# EAGLE design simple-loop-active1 (EAGLE 6.6.0)

## Sheet 1 of 2
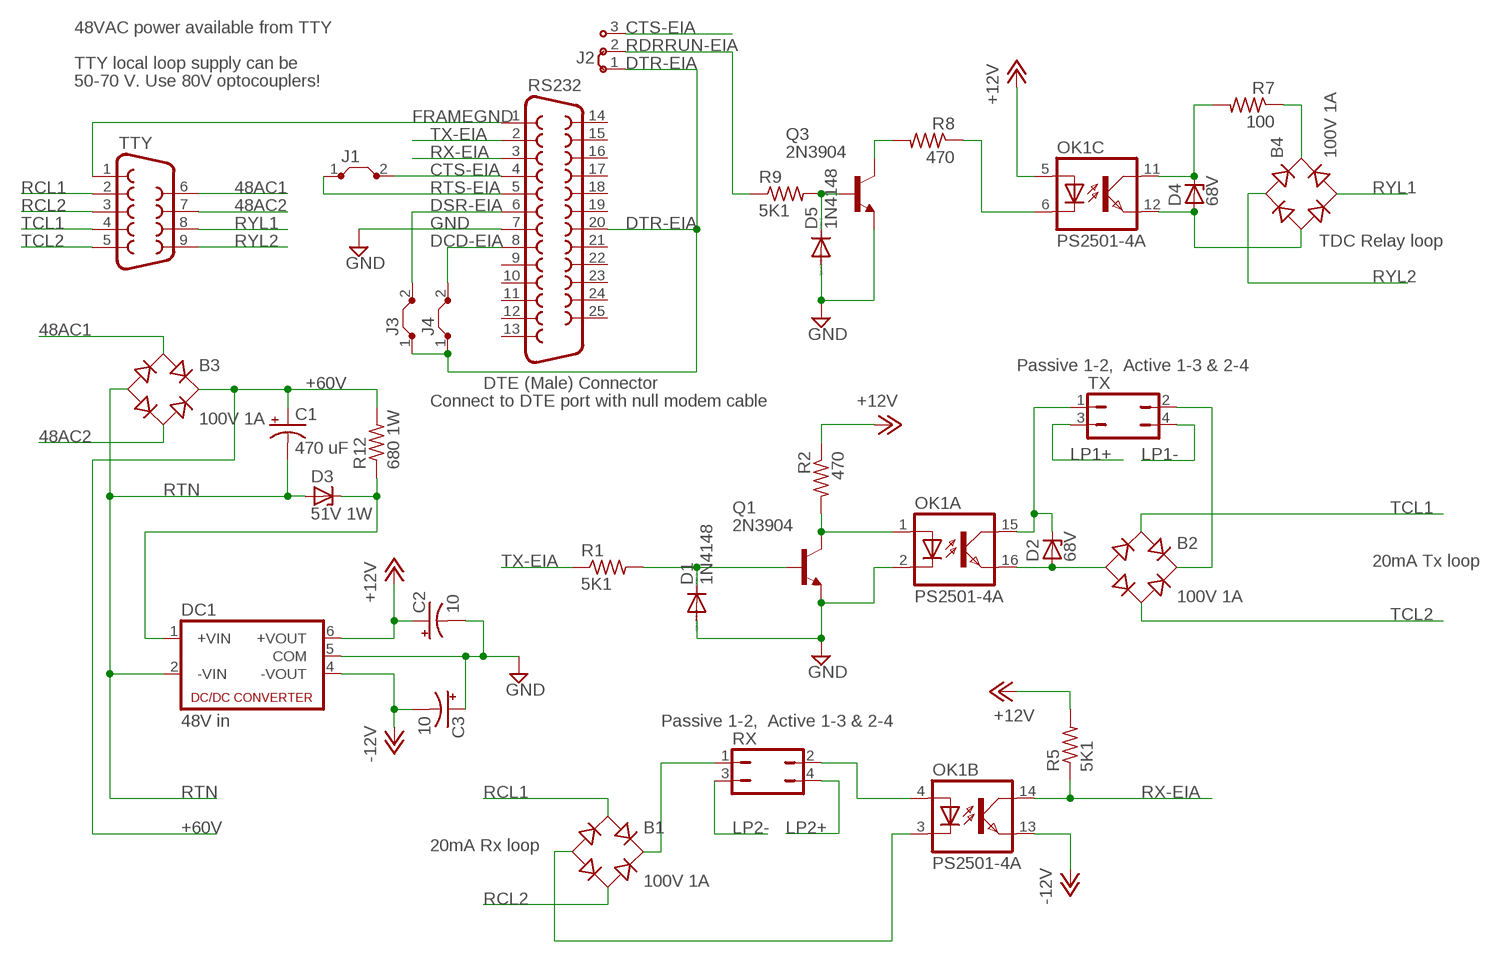
[diagram p0: schematic, sheet 1]

### Parts
B1  100V 1A  RB1A  [RB1A]
B2  100V 1A  RB1A  [RB1A]
B3  100V 1A  RB1A  [RB1A]
B4  100V 1A  RB1A  [RB1A]
C1  470 uF  CPOL-USE7.5-18  [E7,5-18]
C2  10  CPOL-USB45181A  [B45181A]
C3  10  CPOL-USB45181A  [B45181A]
D1  1N4148  1N4148DO35-10  [DO35-10]
D2  68V  ZENER-DIODEDO41Z10  [DO41Z10]
D3  51V 1W  ZENER-DIODEDO41Z10  [DO41Z10]
D4  68V  ZENER-DIODEDO41Z10  [DO41Z10]
D5  1N4148  1N4148DO35-10  [DO35-10]
DC1  48V in  NMA  [NMA]
J1  J5MM  [05]
J2  J2X5MM  [05C]
J3  J5MM  [05]
J4  J5MM  [05]
OK1  PS2501-4A  ILQ1  [DIL16]
Q1  2N3904  [TO92]
Q3  2N3904  [TO92]
R1  5K1  R-US_0207/10  [0207/10]
R2  470  R-US_0207/10  [0207/10]
R5  5K1  R-US_0207/10  [0207/10]
R7  100  R-US_0207/10  [0207/10]
R8  470  R-US_0207/10  [0207/10]
R9  5K1  R-US_0207/10  [0207/10]
R12  680 1W  R-US_0817/7V  [P0817V]
RS232  F25H  [F25H]
RX  JP2Q  [JP2Q]
TTY  F09H  [F09H]
TX  JP2Q  [JP2Q]

### Nets
48AC1: B3.AC1 TTY.6
48AC2: B3.AC2 TTY.7
+12V: C2.+ DC1.6(+VOUT) OK1.5(C:A) R2.1 R5.2
+48VDC: D3.C DC1.1(+VIN) R12.1
+60V: B3.+ C1.+ R12.2 ; also sheet 2
-12V: C3.- DC1.4(-VOUT) OK1.13(B:EMIT)
CTS-EIA: J1.2 J2.3 RS232.4
DCD-EIA: J4.2 RS232.8
DSR-EIA: J3.2 RS232.6
DTR-EIA: J2.1 J3.1 J4.1 RS232.20
FRAMEGND: RS232.1 TTY.1
GND [GND]: C2.- C3.+ D1.A D5.A DC1.5(COM) OK1.2(A:C) Q1.3(E) Q3.3(E) RS232.7
LP1+: TX.3 ; also sheet 2
LP1-: TX.4 ; also sheet 2
LP2+: RX.4 ; also sheet 2
LP2-: RX.3 ; also sheet 2
N$1: OK1.4(B:A) RX.2
N$2: B1.+ RX.1
N$3: B1.- OK1.3(B:C)
N$4: B2.- D2.A OK1.16(A:EMIT)
N$6: D2.C OK1.15(A:COL) TX.1
N$7: D1.C Q1.2(B) R1.2
N$9: OK1.1(A:A) Q1.1(C) R2.2
N$11: D4.C OK1.11(C:COL) R7.2
N$12: B4.- D4.A OK1.12(C:EMIT)
N$13: B4.+ R7.1
N$15: OK1.6(C:C) R8.1
N$16: D5.C Q3.2(B) R9.2
N$17: Q3.1(C) R8.2
N$19: B2.+ TX.2
RCL1: B1.AC1 TTY.2
RCL2: B1.AC2 TTY.3
RDRRUN-EIA: J2.2 R9.1
RTN: B3.- C1.- D3.A DC1.2(-VIN) ; also sheet 2
RTS-EIA: J1.1 RS232.5
RX-EIA: OK1.14(B:COL) R5.1 RS232.3
RYL1: B4.AC2 TTY.8
RYL2: B4.AC1 TTY.9
TCL1: B2.AC1 TTY.4
TCL2: B2.AC2 TTY.5
TX-EIA: R1.1 RS232.2
Unconnected: RS232.9 RS232.10 RS232.11 RS232.12 RS232.13 RS232.14 RS232.15 RS232.16 RS232.17 RS232.18 RS232.19 RS232.21 RS232.22 RS232.23 RS232.24 RS232.25

### Notes on the sheet
- 48VAC power available from TTY
- TTY local loop supply can be
- 50-70 V. Use 80V optocouplers!
- TDC Relay loop
- Passive 1-2,  Active 1-3 & 2-4
- DTE (Male) Connector
- Connect to DTE port with null modem cable
- 20mA Tx loop
- Passive 1-2,  Active 1-3 & 2-4
- 20mA Rx loop

## Sheet 2 of 2
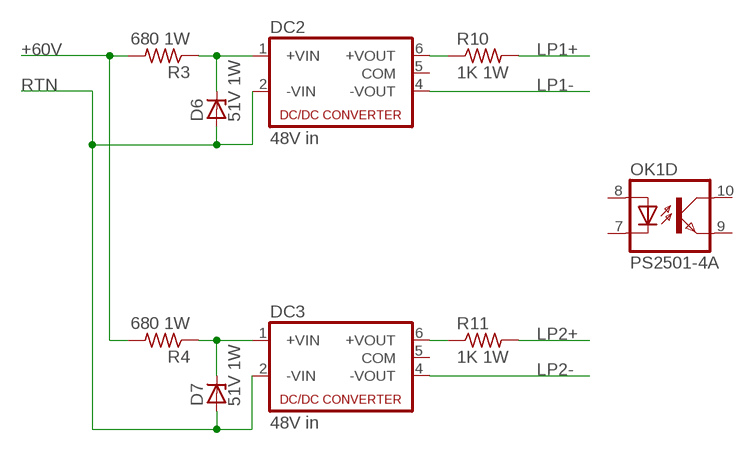
[diagram p1: schematic, sheet 2]

### Parts
D6  51V 1W  ZENER-DIODEDO41Z10  [DO41Z10]
D7  51V 1W  ZENER-DIODEDO41Z10  [DO41Z10]
DC2  48V in  NMA  [NMA]
DC3  48V in  NMA  [NMA]
R3  680 1W  R-US_0817/7V  [P0817V]
R4  680 1W  R-US_0817/7V  [P0817V]
R10  1K 1W  R-US_0817/7V  [P0817V]
R11  1K 1W  R-US_0817/7V  [P0817V]

### Nets
+48VDC1: D6.C DC2.1(+VIN) R3.1
+48VDC2: D7.C DC3.1(+VIN) R4.1
+60V: R3.2 R4.2 ; also sheet 1
LP1+: R10.2 ; also sheet 1
LP1-: DC2.4(-VOUT) ; also sheet 1
LP2+: R11.2 ; also sheet 1
LP2-: DC3.4(-VOUT) ; also sheet 1
N$8: DC2.6(+VOUT) R10.1
N$10: DC3.6(+VOUT) R11.1
RTN: D6.A D7.A DC2.2(-VIN) DC3.2(-VIN) ; also sheet 1
Unconnected: DC2.5(COM) DC3.5(COM) OK1.7(D:C) OK1.8(D:A) OK1.9(D:EMIT) OK1.10(D:COL)

## Library data of the parts
B1-B4 = rectifier:RB1A: RECTIFIER 1 A
C1-C3 = rcl:CPOL-US: POLARIZED CAPACITOR, American symbol
D1 D5 = diode:1N4148: DIODE high speed (Philips)
D2-D4 D6 D7 = diode:ZENER-DIODE: Z-Diode
DC1-DC3 = dc-dc-converter:NMA: DC-DC CONVERTER; MF: C & D TECHNOLOGIES, INC; MPN: NMA0515SC; OC_FARNELL: 1021434; OC_NEWARK: 61K3064
J1 J3 J4 = jumper:J: Bridge
J2 = jumper:J2: Jumper switch 2 x 2.5 mm
OK1 = optocoupler:ILQ1: SIEMENS OPTO COUPLER; MF: VISHAY/TELEFUNKEN; MPN: ILQ1; OC_FARNELL: 1469501; OC_NEWARK: 88K1954
Q1 Q3 = transistor-npn:2N3904: NPN Transistor
R1-R5 R7-R12 = rcl:R-US_: RESISTOR, American symbol
RS232 = con-subd:F25: SUB-D; OC_FARNELL: unknown; OC_NEWARK: unknown
RX TX = dec-con:JP2Q: JUMPER
TTY = con-subd:F09: SUB-D; OC_FARNELL: unknown; OC_NEWARK: unknown

## Net classes
1 GND: width 0.508 mm

## Board
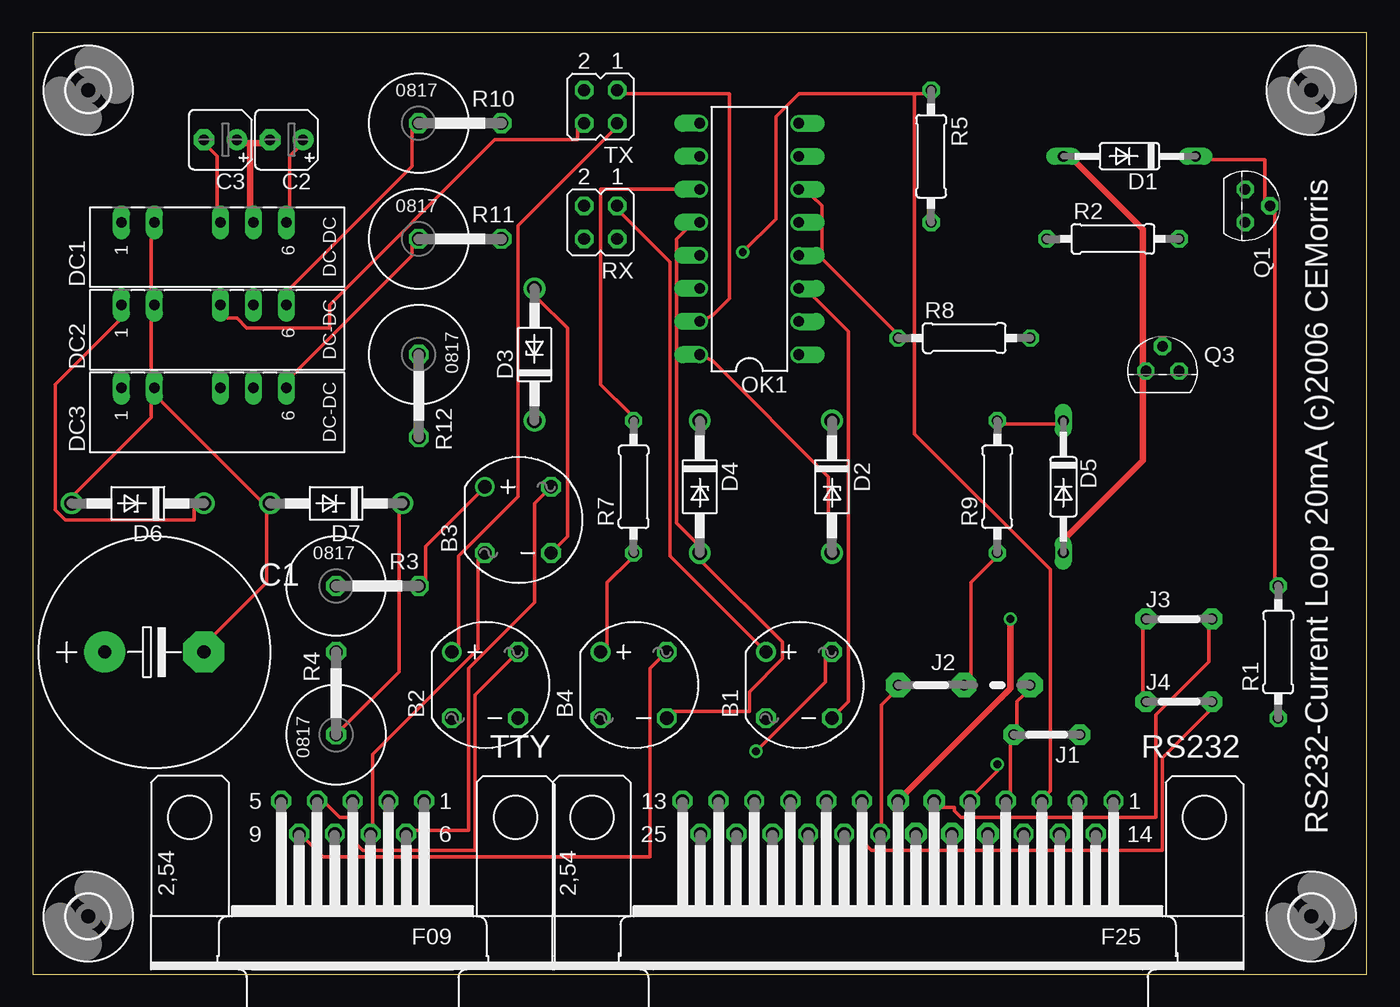
[diagram p2: board, top side]
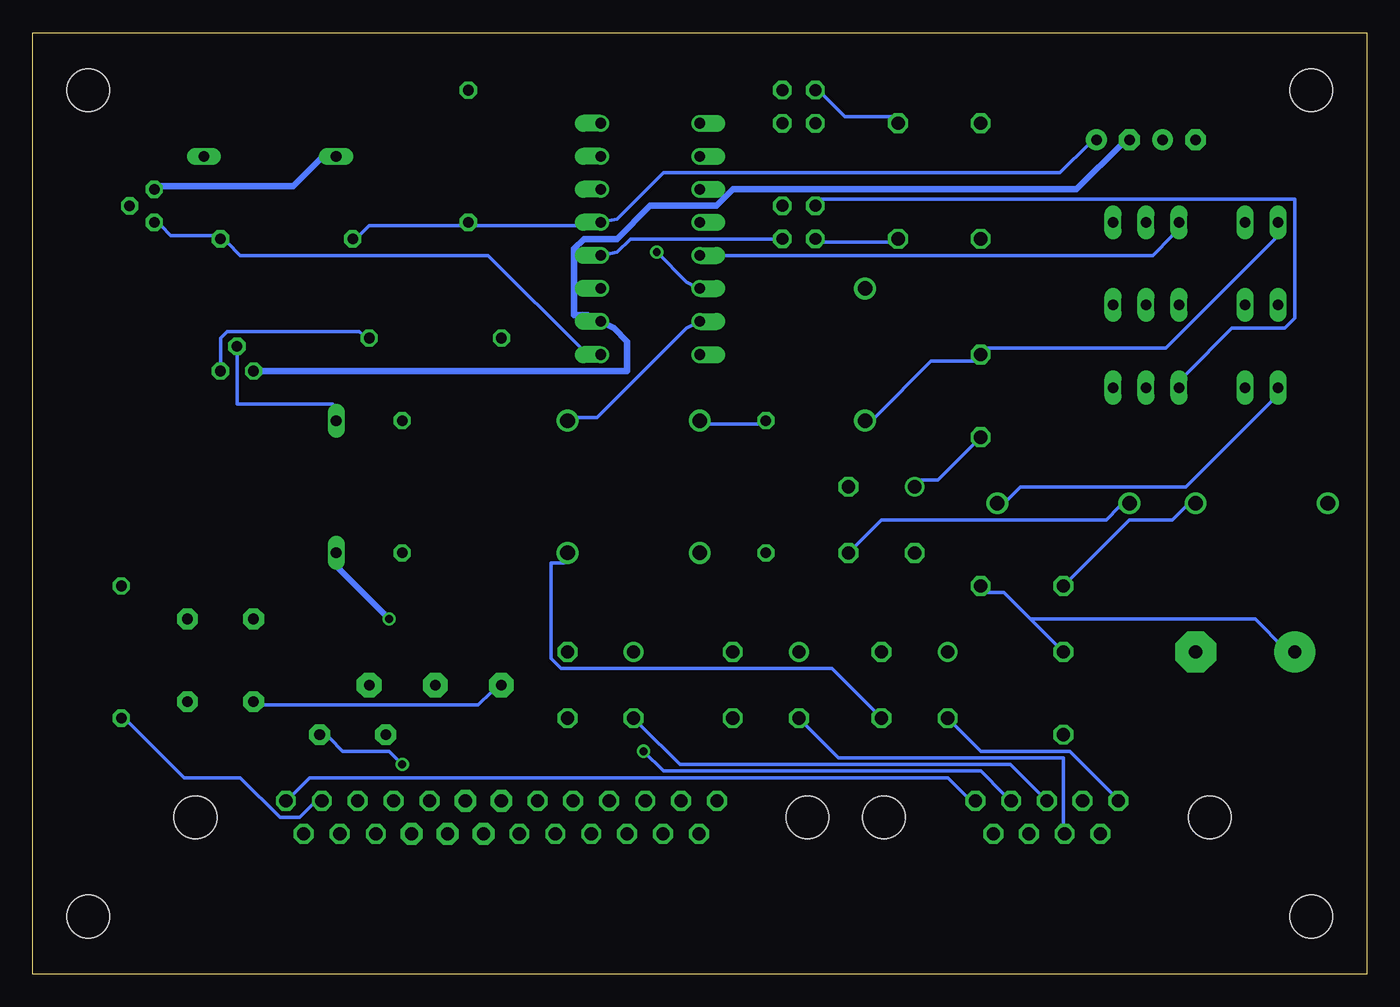
[diagram p3: board, bottom side, seen from below]

Size 102.54 x 72.37 mm. Coordinates in mm from the lower left corner, seen from the top.
Outline: 102.54,0 102.54,72.37 0,72.37 0,0 102.54,0
Copper layers (1*16): Top 0.035mm / dielectric 1.5mm / Bottom 0.035mm
Design rules "10mils *": minimum track width 10mil, minimum drill 24mil, track to track 10mil, track to pad 10mil, pad to pad 10mil, via to via 10mil, smd to smd 10mil, copper to edge 40mil, drill to drill 10mil, minimum pad ring 10mil, minimum via ring 8mil, stop-mask expansion 0mil, vias tented up to drill 0mil, thermal gap 10mil

### Footprints (pad centres in the part's own frame; a part is rotated, then mirrored left to right if it is on the bottom)
RB1A = drill 1.016: + -2.54,2.54 | drill 1.016 octagon: - 2.54,-2.54; AC1 2.54,2.54; AC2 -2.54,-2.54
E7,5-18 = drill 1.016 pad 3.15: + -3.81,0 | drill 1.016 pad 3.15 octagon: - 3.81,0
B45181A = drill 0.813 pad 1.6: + -1.27,0 | drill 0.813 pad 1.6 octagon: - 1.27,0
DO35-10 = drill 0.813 long: A 5.08,0; C -5.08,0
DO41Z10 = drill 1.118: A 5.08,0; C -5.08,0
NMA = drill 0.813 long: 1 0,6.35; 2 0,3.81; 4 0,-1.27; 5 0,-3.81; 6 0,-6.35
05 = drill 0.813 pad 1.6 octagon: 1 -2.54,0; 2 2.54,0
05C = drill 0.813 pad 1.905 octagon: 1 -2.54,0; 2 2.54,0; 3 7.62,0
DIL16 = drill 0.813 offset: 1 -8.89,-3.81; 2 -6.35,-3.81; 3 -3.81,-3.81; 4 -1.27,-3.81; 5 1.27,-3.81; 6 3.81,-3.81; 7 6.35,-3.81; 8 8.89,-3.81; 9 8.89,3.81; 10 6.35,3.81; 11 3.81,3.81; 12 1.27,3.81; 13 -1.27,3.81; 14 -3.81,3.81; 15 -6.35,3.81; 16 -8.89,3.81
TO92 = drill 0.813 octagon: 1 1.27,0; 2 0,1.905; 3 -1.27,0
0207/10 = drill 0.813 octagon: 1 -5.08,0; 2 5.08,0
P0817V = drill 1.016 octagon: 1 -5.08,0; 2 1.27,0
F25H = drill 1.016 octagon: 1 -16.561,-1.27; 2 -13.792,-1.27; 3 -11.049,-1.27; 4 -8.28,-1.27; 5 -5.512,-1.27; 8 2.769,-1.27; 9 5.512,-1.27; 10 8.28,-1.27; 11 11.049,-1.27; 12 13.792,-1.27; 13 16.561,-1.27; 14 -15.189,1.27; 15 -12.421,1.27; 16 -9.652,1.27; 20 1.372,1.27; 21 4.14,1.27; 22 6.909,1.27; 23 9.652,1.27; 24 12.421,1.27; 25 15.189,1.27 | drill 1.016 pad 1.67 octagon: 6 -2.769,-1.27; 7 0,-1.27; 17 -6.909,1.27; 18 -4.14,1.27; 19 -1.372,1.27 | hole 3.302: -23.52,0; 23.52,0
JP2Q = drill 0.914 octagon: 1 -1.27,-1.27; 2 -1.27,1.27; 3 1.27,-1.27; 4 1.27,1.27
F09H = drill 1.016 octagon: 1 -5.486,-1.27; 2 -2.743,-1.27; 3 0,-1.27; 4 2.743,-1.27; 5 5.486,-1.27; 6 -4.115,1.27; 7 -1.372,1.27; 8 1.372,1.27; 9 4.115,1.27 | hole 3.302: -12.522,0; 12.522,0
3,3 = hole 3.3: 0,0

### Placement (x,y rotation side)
B1  58.89,22.22 0 top
B2  34.76,22.22 0 top
B3  37.3,34.92 0 top
B4  46.19,22.22 0 top
C1  9.36,24.76 0 top
C2  19.52,64.13 180 top
C3  14.44,64.13 180 top
D1  84.29,62.86 180 top
D2  61.43,37.46 270 top
D3  38.57,47.62 90 top
D4  51.27,37.46 270 top
D5  79.21,37.46 270 top
D6  8.09,36.19 180 top
D7  23.33,36.19 180 top
DC1  13.17,57.78 90 top
DC2  13.17,51.43 90 top
DC3  13.17,45.08 90 top
J1  77.94,18.41 180 top
J2  69.05,22.22 0 top
J3  88.1,27.3 0 top
J4  88.1,20.95 0 top
OK1  55.08,56.51 90 top
Q1  93.18,59.05 270 top
Q3  86.83,46.35 0 top
R1  95.72,24.76 90 top
R2  83.02,56.51 0 top
R3  28.41,29.84 0 top
R4  23.33,23.49 90 top
R5  69.05,62.86 270 top
R7  46.19,37.46 90 top
R8  71.59,48.89 0 top
R9  74.13,37.46 90 top
R10  34.76,65.4 0 top
R11  34.76,56.51 0 top
R12  29.68,42.54 270 top
RS232  66.51,12.06 180 top
RX  43.65,57.78 180 top
TTY  24.6,12.06 180 top
TX  43.65,66.67 180 top
U$1  [3,3]  4.28,67.94 0 top
U$2  [3,3]  4.28,4.44 0 top
U$3  [3,3]  98.26,67.94 0 top
U$4  [3,3]  98.26,4.44 0 top

### Tracks (layer width: path | path; a pad name or v marks a point on that pad's centre or on a via)
48AC1
  Top 0.254: TTY.6 29.43,11.04 33.49,11.04 33.49,23.49 38.57,28.57 38.57,36.19 39.33,36.95 B3.AC1
48AC2
  Top 0.254: TTY.7 26.12,11.3 26.12,16.89 34.25,25.01 34.25,31.87 B3.AC2
+12V
  Top 0.254: C2.+ 20.54,63.62 19.77,62.86 19.77,59.05 DC1.6
  Bottom 0.254: R2.1 77.43,56.76 76.67,57.53 69.56,57.53 R5.2 68.54,57.53 60.16,57.53 OK1.5 57.62,58.03 54.06,61.59 23.58,61.59 21.3,63.88 C2.+
+48VDC
  Bottom 0.254: DC1.1 7.07,56.51 15.46,48.13 29.17,48.13 R12.1 30.19,47.11 33.49,47.11 37.81,42.79 D3.C
+48VDC1
  Top 0.254: DC2.1 6.57,50.16 1.74,45.33 1.74,35.68 2.5,34.92 12.41,34.92 12.41,35.94 D6.C
  Bottom 0.254: R3.1 22.82,30.35 18.25,34.92 14.95,34.92 13.93,35.94 D6.C
+48VDC2
  Top 0.254: R4.1 23.84,18.92 28.16,23.24 28.16,35.43 D7.C
  Bottom 0.254: DC3.1 7.33,44.06 13.93,37.46 26.63,37.46 27.65,36.44 D7.C
+60V
  Top 0.254: B3.+ 30.19,32.89 30.19,30.35 R3.2
  Bottom 0.254: R12.2 32.98,37.97 34.25,37.97 B3.+ | 25.87,27.3 27.9,29.33 29.17,29.33 R3.2 | 25.87,27.3 R4.2 | 25.87,27.3 8.6,27.3 6.31,25.01 C1.+
-12V
  Top 0.254: C3.- 13.42,63.62 14.19,62.86 14.19,59.05 DC1.4
  Bottom 0.254: OK1.13 16.47,55.24 14.95,56.76 DC1.4
CTS-EIA
  Top 0.254: RS232.4 75.15,13.84 75.15,17.65 J1.2 75.65,19.17 75.65,20.95 76.16,21.46 J2.3
DCD-EIA
  Top 0.254: RS232.8 63.97,12.82 63.97,10.03 64.48,9.52 86.83,9.52 86.83,16.63 90.39,20.19 J4.2
DSR-EIA
  Top 0.254: RS232.6 69.81,12.82 70.83,12.82 70.83,12.57 71.34,12.06 86.32,12.06 86.32,19.93 90.39,24 90.39,26.54 J3.2
DTR-EIA
  Top 0.254: J4.1 85.31,21.71 85.31,26.54 J3.1 | RS232.20 65.24,11.3 65.24,20.7 66,21.46 J2.1
  Bottom 0.254: J4.1 84.8,20.7 68.29,20.7 67.27,21.71 J2.1
FRAMEGND
  Bottom 0.254: TTY.1 30.7,13.58 32.22,15.11 81.24,15.11 82.51,13.84 RS232.1
GND  (via drill 0.61)
  Top 0.508: 16.73,63.88 17.74,63.88 C2.- | 16.73,63.88 16.22,63.88 C3.+ | 16.73,63.88 16.73,59.05 DC1.5 | D5.A 79.46,33.65 85.31,39.49 85.31,45.84 Q3.3 85.31,46.86 85.31,57.27 80.23,62.35 D1.A | RS232.7 75.15,21.97 v75.15,27.3
  Bottom 0.508: D1.A 80.48,62.61 82.51,60.57 92.67,60.57 Q1.3 | Q3.3 56.86,46.35 56.86,48.64 57.87,49.65 OK1.2 59.91,50.67 60.92,50.67 60.92,55.75 60.16,56.51 57.62,56.51 55.08,59.05 50,59.05 48.73,60.32 22.31,60.32 18.76,63.88 C2.- | v75.15,27.3 78.96,31.11 D5.A
LP1+
  Bottom 0.254: TX.3 41.87,67.69 40.09,65.91 36.54,65.91 R10.2
LP1-
  Top 0.254: DC2.4 14.95,50.41 15.71,50.41 16.47,49.65 22.82,49.65 22.82,51.43 35.52,64.13 41.87,64.13 41.87,65.15 TX.4
LP2+
  Bottom 0.254: RX.4 41.87,56.26 36.54,56.26 R11.2
LP2-
  Bottom 0.254: DC3.4 13.93,46.1 10.38,49.65 6.31,49.65 5.55,50.41 5.55,59.56 42.13,59.56 RX.3
N$1
  Bottom 0.254: OK1.4 57.62,55.49 56.6,56.51 45.43,56.51 RX.2
N$2
  Top 0.254: RX.1 45.17,58.54 48.98,54.73 48.98,32.13 55.84,25.27 B1.+
N$3
  Top 0.254: OK1.3 59.91,52.19 62.7,49.4 62.7,20.95 61.94,20.19 B1.-
N$4
  Top 0.254: OK1.16 52.29,47.11 61.18,38.22 61.18,33.14 D2.A
  Bottom 0.254: B2.- 37.81,20.19 41.11,23.49 61.94,23.49 62.7,24.25 62.7,31.62 61.68,31.62 D2.A
N$6
  Top 0.254: TX.1 45.43,67.69 53.56,67.69 53.56,51.94 52.29,50.67 OK1.15
  Bottom 0.254: OK1.15 52.29,49.65 59.14,42.79 60.67,42.79 D2.C
N$7
  Top 0.254: R1.2 95.47,30.35 95.47,58.54 Q1.2 94.7,59.56 94.7,62.61 90.64,62.61 D1.C
N$8
  Top 0.254: DC2.6 19.77,52.7 29.17,62.1 29.17,64.89 R10.1
N$9
  Bottom 0.254: OK1.1 60.16,47.87 67.53,55.24 86.58,55.24 87.59,56.26 R2.2 88.61,56.76 91.91,56.76 92.67,57.53 Q1.1
N$10
  Top 0.254: DC3.6 20.03,46.1 29.17,55.24 29.17,56 R11.1
N$11
  Top 0.254: OK1.11 50,60.32 43.65,60.32 43.65,45.33 45.94,43.05 R7.2
  Bottom 0.254: R7.2 46.7,42.29 50.51,42.29 D4.C
N$12
  Top 0.254: OK1.12 50.25,57.27 49.49,56.51 49.49,34.67 51.02,33.14 D4.A 51.52,31.62 57.62,25.52 57.62,24.25 55.08,21.71 55.08,20.19 49.24,20.19 B4.-
N$13
  Top 0.254: R7.1 45.94,31.87 44.16,30.09 44.16,25.27 B4.+
N$15
  Top 0.254: R8.1 66.26,49.4 60.67,54.99 60.67,59.05 59.91,59.81 OK1.6
N$16
  Top 0.254: R9.2 74.64,42.29 78.7,42.29 D5.C
  Bottom 0.254: Q3.2 86.83,47.62 86.83,43.81 79.46,43.81 D5.C
N$17
  Bottom 0.254: R8.2 77.18,49.14 77.43,49.4 87.59,49.4 88.1,48.89 88.1,46.86 Q3.1
N$19
  Top 0.254: TX.2 44.67,64.89 37.3,57.53 37.3,36.7 32.73,32.13 32.73,25.27 B2.+
RCL1  (via drill 0.61)
  Top 0.254: v55.59,17.14 60.92,22.47 60.92,24.25 B1.AC1
  Bottom 0.254: v55.59,17.14 54.06,15.62 29.68,15.62 27.9,13.84 TTY.2
RCL2
  Bottom 0.254: TTY.3 25.11,13.84 27.39,16.12 52.79,16.12 55.84,19.17 B1.AC2
RDRRUN-EIA
  Top 0.254: R9.1 73.88,31.87 72.1,30.09 72.1,22.98 J2.2
RTN
  Top 0.254: B3.- 41.11,33.65 41.11,49.65 38.82,51.94 D3.A | DC3.2 9.11,46.35 9.11,50.16 DC2.2 9.11,52.7 9.11,56.51 DC1.2 | D6.A 3.26,36.95 9.11,42.79 9.11,43.81 DC3.2 | DC3.2 9.87,44.06 17.49,36.44 D7.A 18,35.43 18,30.09 13.42,25.52 C1.-
  Bottom 0.254: B3.- 37.3,34.92 20.03,34.92 19.01,35.94 D7.A
RTS-EIA  (via drill 0.61)
  Top 0.254: v74.13,16.12 74.13,15.62 72.35,13.84 RS232.5
  Bottom 0.254: v74.13,16.12 75.15,17.14 78.7,17.14 79.72,18.16 J1.1
RX-EIA  (via drill 0.61)
  Top 0.254: v54.57,55.49 57.11,58.03 57.11,65.91 58.89,67.69 67.78,67.69 | 67.78,67.69 68.54,67.69 R5.1 | 67.78,67.69 67.78,41.52 78.19,31.11 78.19,14.09 77.94,13.84 RS232.3
  Bottom 0.254: v54.57,55.49 52.29,53.21 OK1.14
RYL1
  Bottom 0.254: TTY.8 23.33,11.3 23.33,16.63 40.6,16.63 43.14,19.17 B4.AC2
RYL2
  Top 0.254: TTY.9 21.04,10.28 22.31,9.01 47.46,9.01 47.46,23.49 48.22,24.25 B4.AC1
TCL1
  Top 0.254: TTY.4 22.57,13.08 23.58,12.06 24.6,12.06 24.6,10.28 25.36,9.52 34,9.52 34,21.46 36.79,24.25 B2.AC1
TCL2
  Bottom 0.254: TTY.5 19.52,13.84 22.82,17.14 29.68,17.14 31.71,19.17 B2.AC2
TX-EIA
  Bottom 0.254: R1.1 95.21,19.43 90.89,15.11 86.58,15.11 83.53,12.06 82,12.06 80.99,13.08 RS232.2

### Text on the board
tNames: RS232-Current Loop 20mA (c)2006 CEMorris